# Altium schematic sheet Sheet1.SchDoc
size A4
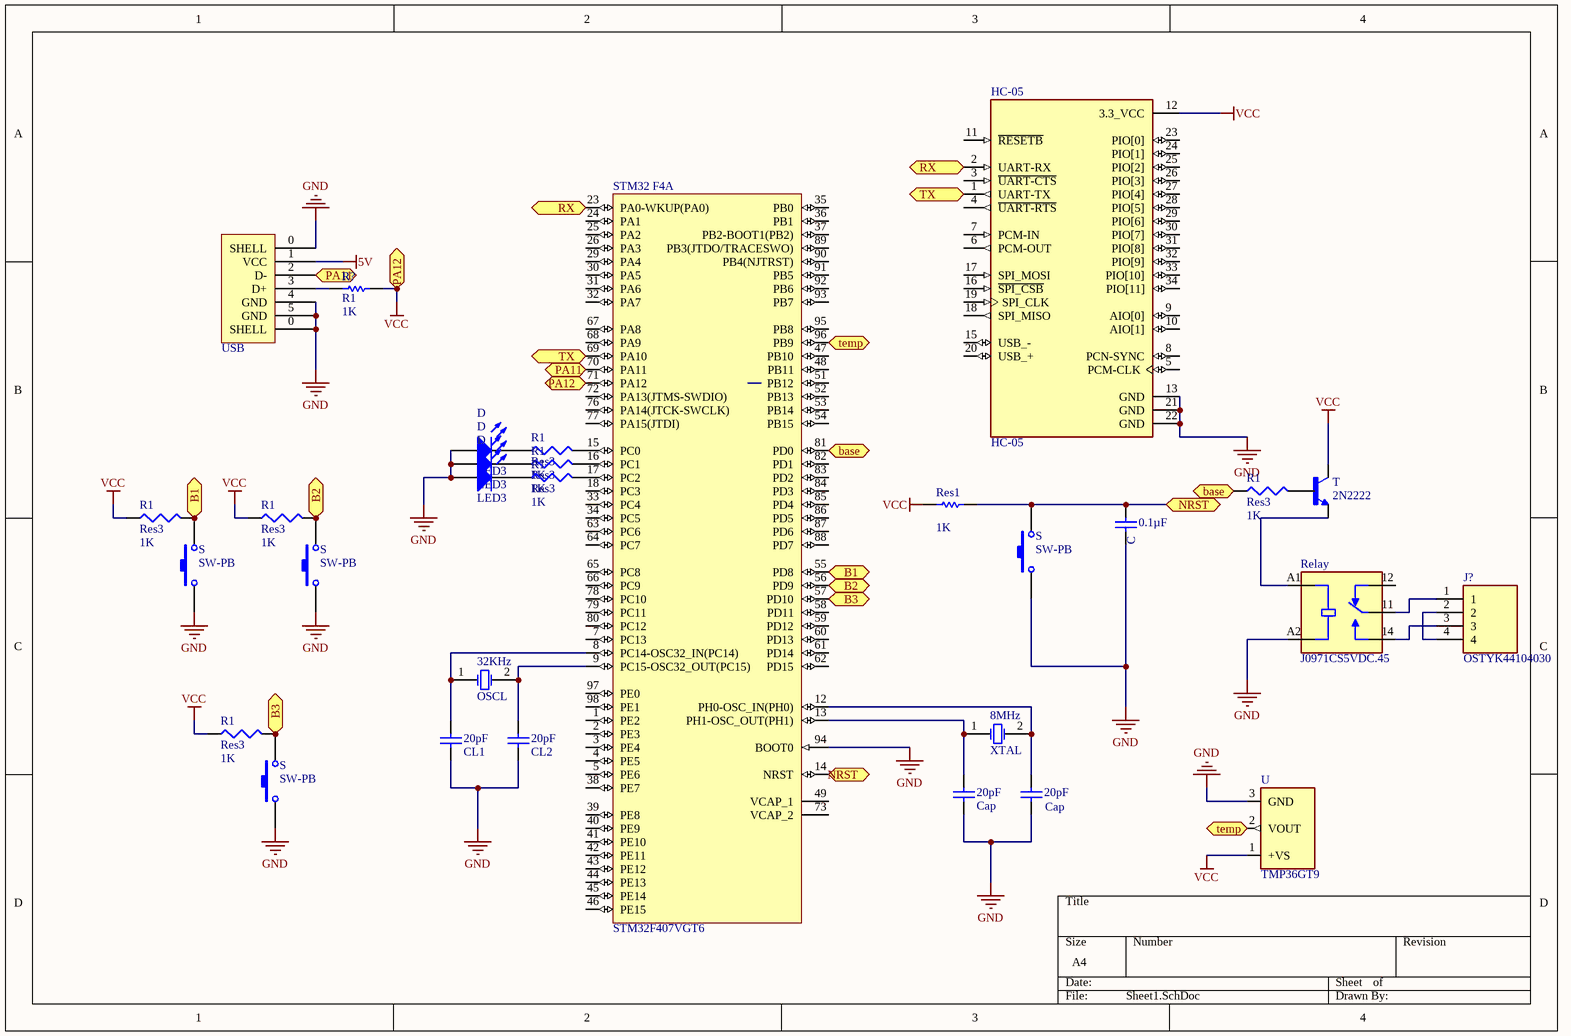
[diagram p0: Sheet1.SchDoc]

## Parts
(Parts that share a designator on the sheet are numbered #1, #2 ... from top to bottom, then left to right.)
0.1µF  C  [RAD-0.3]
8MHz  XTAL  [R38]
20pF#1  CL1  [RAD-0.3]
20pF#2  CL2  [RAD-0.3]
20pF#3  Cap  [RAD-0.3]
20pF#4  Cap  [RAD-0.3]
32KHz  OSCL  [R38]
D#1  LED3  [3.5X2.8X1.9]
D#2  LED3  [3.5X2.8X1.9]
D#3  LED3  [3.5X2.8X1.9]
HC-05  HC-05  [XCVR_HC-05]
J?  OSTYK44104030  [OST_OSTYK44104030]
R1#1  Res3  value 1K  [J1-0603]
R1#2  Res3  value 1K  [J1-0603]
R1#3  Res3  value 1K  [J1-0603]
R1#4  Res3  value 1K  [J1-0603]
R1#5  Res3  value 1K  [J1-0603]
R1#6  Res3  value 1K  [J1-0603]
R1#7  Res3  value 1K  [J1-0603]
R?  R1  value 1K  [AXIAL-0.3]
Relay  J0971CS5VDC.45  [RELAY_J0971CS5VDC.45]
Res1  value 1K  [AXIAL-0.3]
S#1  SW-PB  [SPST-2]
S#2  SW-PB  [SPST-2]
S#3  SW-PB  [SPST-2]
S#4  SW-PB  [SPST-2]
STM32_F4  STM32F407VGT6  [STM-LQFP100_N]  (part A of 2)
T  2N2222  [TO127P584H533-3]
U  TMP36GT9  [XDCR_TMP36GT9]
USB  USB connector  [usb_B]  (value not drawn)

## Ports
B1, B2, B3, base, NRST, PA11, PA12, RX, temp, TX

## Nets
5V: USB.1(VCC)
GND: 0.1µF.1 20pF#1.1 20pF#2.1 20pF#3.1 20pF#4.1 D#1.1(A) D#2.1(A) D#3.1(A) HC-05.13(GND) HC-05.21(GND) HC-05.22(GND) Relay.A2(COIL2) S#1.1 S#2.1 S#3.1 S#4.1 STM32_F4.94(BOOT0) U.3(GND) USB.0(SHELL) USB.4(GND) USB.5(GND)
VCC: HC-05.12(3.3_VCC) R1#5.1 R1#6.1 R1#7.1 R?.2 Res1.1 STM32_F4.71(PA12) T.3(C) U.1(+VS) ; port PA12
B1: R1#5.2 S#2.2 STM32_F4.55(PD8) ; port B1
B2: R1#6.2 S#3.2 STM32_F4.56(PD9) ; port B2
B3: R1#7.2 S#4.2 STM32_F4.57(PD10) ; port B3
base: R1#4.1 STM32_F4.81(PD0) ; port base
NRST: 0.1µF.2 Res1.2 S#1.2 STM32_F4.14(NRST) ; port NRST
PA11: STM32_F4.70(PA11) USB.2(D-) ; port PA11
RX: HC-05.2(UART-RX) STM32_F4.23(PA0-WKUP(PA0)) ; port RX
temp: STM32_F4.96(PB9) U.2(VOUT) ; port temp
TX: HC-05.1(UART-TX) STM32_F4.69(PA10) ; port TX
Net8MHz_1: 8MHz.1(OSC1) 20pF#3.2 STM32_F4.13(PH1-OSC_OUT(PH1))
Net8MHz_2: 8MHz.2(OSC2) 20pF#4.2 STM32_F4.12(PH0-OSC_IN(PH0))
Net20pF#1_2: 20pF#1.2 32KHz.1(OSC1) STM32_F4.8(PC14-OSC32_IN(PC14))
Net20pF#2_2: 20pF#2.2 32KHz.2(OSC2) STM32_F4.9(PC15-OSC32_OUT(PC15))
NetD#1_2: D#1.2(K) R1#1.1
NetD#2_2: D#2.2(K) R1#2.1
NetD#3_2: D#3.2(K) R1#3.1
NetJ?_1: J?.1 Relay.11(COM)
NetJ?_2: J?.2 J?.4
NetJ?_3: J?.3 Relay.14(NO)
NetR1#1_2: R1#1.2 STM32_F4.15(PC0)
NetR1#2_2: R1#2.2 STM32_F4.16(PC1)
NetR1#3_2: R1#3.2 STM32_F4.17(PC2)
NetR1#4_2: R1#4.2 T.2(B)
NetR?_1: R?.1 USB.3(D+)
NetRelay_A1: Relay.A1(COIL1) T.1(E)

Not connected (* = marked no-connect by the designer): HC-05 3(~{UART-CTS}) 4(~{UART-RTS}) 5(PCM-CLK) 6(PCM-OUT) 7(PCM-IN) 8(PCN-SYNC) 9(AIO[0]) 10(AIO[1]) 11(~{RESETB}) 15(USB_-) 16(~{SPI_CSB}) 17(SPI_MOSI) 18(SPI_MISO) 19(SPI_CLK) 20(USB_+) 23(PIO[0]) 24(PIO[1]) 25(PIO[2]) 26(PIO[3]) 27(PIO[4]) 28(PIO[5]) 29(PIO[6]) 30(PIO[7]) 31(PIO[8]) 32(PIO[9]) 33(PIO[10]) 34(PIO[11]); Relay 12(NC); STM32_F4 1(PE2) 2(PE3) 3(PE4) 4(PE5) 5(PE6) 7(PC13) 18(PC3) 24(PA1) 25(PA2) 26(PA3) 29(PA4) 30(PA5) 31(PA6) 32(PA7) 33(PC4) 34(PC5) 35(PB0) 36(PB1) 37(PB2-BOOT1(PB2)) 38(PE7) 39(PE8) 40(PE9) 41(PE10) 42(PE11) 43(PE12) 44(PE13) 45(PE14) 46(PE15) 47(PB10) 48(PB11) 49(VCAP_1) 51(PB12) 52(PB13) 53(PB14) 54(PB15) 58(PD11) 59(PD12) 60(PD13) 61(PD14) 62(PD15) 63(PC6) 64(PC7) 65(PC8) 66(PC9) 67(PA8) 68(PA9) 72(PA13(JTMS-SWDIO)) 73(VCAP_2) 76(PA14(JTCK-SWCLK)) 77(PA15(JTDI)) 78(PC10) 79(PC11) 80(PC12) 82(PD1) 83(PD2) 84(PD3) 85(PD4) 86(PD5) 87(PD6) 88(PD7) 89(PB3(JTDO/TRACESWO)) 90(PB4(NJTRST)) 91(PB5) 92(PB6) 93(PB7) 95(PB8) 97(PE0) 98(PE1)

## Library data of the parts
0.1µF 20pF#1-20pF#4 = Cap: Capacitor; Published: 8-Jun-2000; LatestRevisionDate: 17-Jul-2002; LatestRevisionNote: Re-released for DXP Platform.; PackageReference: RAD-0.3; Publisher: Altium Limited; PackageDescription: Radial Cap, Thru-Hole; 2 Leads; 0.3 in Pin Spacing
8MHz 32KHz = XTAL: Crystal Oscillator; Published: 8-Jun-2000; LatestRevisionDate: 17-Jul-2002; LatestRevisionNote: Re-released for DXP Platform.; PackageReference: R38; Publisher: Altium Limited; PackageDescription: Crystal, Thru-Hole; 2 Leads; Body 3.1 x 8.2 mm (Dia.xH)
D#1-D#3 = LED3: Typical BLUE SiC LED; Published: 8-Jun-2000; LatestRevisionDate: 17-Dec-2003; LatestRevisionNote: PCB Footprint replaced.; DatasheetVersion: 16-Apr-2002; PackageVersion: 16-Apr-2002; PackageReference: 3.5X2.8X1.9; Publisher: Altium Limited; PackageDescription: SM LED; 2 C-Bend Leads; Body 3.5 x 2.8 x 1.9 mm, inc leads (LxWxH typ)
HC-05 = HC-05: Bluetooth to Serial Port Module; MP: HC-05; Value: *; Price: None; Package: None; Availability: Unavailable
J? = OSTYK44104030: 4 Circuit 0.374 (9.50mm) Barrier Block Connector, Screws with Captive Plate; MF: On Shore; MP: OSTYK44104030; Purchase-URL: https://pricing.snapeda.com/search/part/OSTYK44104030/?ref=eda; Price: None; SnapEDA_Link: https://www.snapeda.com/parts/OSTYK44104030/On+Shore+Technology+Inc./view-part/?ref=snap; Check_prices: https://www.snapeda.com/parts/OSTYK44104030/On+Shore+Technology+Inc./view-part/?ref=eda; Package: None; Availability: In Stock; Value: *
R1#1-R1#7 = Res3: Resistor; Published: 8-Jun-2000; LatestRevisionDate: 29-May-2009; LatestRevisionNote: IPC-7351 Footprint Added.; PackageReference: J1-0603; Publisher: Altium Limited; PackageDescription: Chip Resistor
R? Res1 = Res1: Resistor; Published: 8-Jun-2000; LatestRevisionDate: 17-Jul-2002; LatestRevisionNote: Re-released for DXP Platform.; PackageReference: AXIAL-0.3; Publisher: Altium Limited; PackageDescription: Axial Device, Thru-Hole; 2 Leads; 0.3 in Pin Spacing
Relay = J0971CS5VDC.45: General Purpose Relay SPDT (1 Form C) 5VDC Coil Through Hole; MF: CIT Relay and Switch; Value: *; SnapEDA_Link: https://www.snapeda.com/parts/J0971CS5VDC.45/CIT+Relay+%2526+Switch/view-part/?ref=snap; MP: J0971CS5VDC.45; Purchase-URL: https://pricing.snapeda.com/search/part/J0971CS5VDC.45/?ref=eda; Check_prices: https://www.snapeda.com/parts/J0971CS5VDC.45/CIT+Relay+%2526+Switch/view-part/?ref=eda; Availability: In Stock; Price: None; Package: None
S#1-S#4 = SW-PB: Switch; Published: 24-Mar-1999; LatestRevisionDate: 17-Jul-2002; LatestRevisionNote: Re-released for DXP Platform.; PackageReference: SPST-2; Publisher: Altium Limited; PackageDescription: Switch; 2 Leads
STM32_F4 = STM32F407VGT6: ARM Cortex-M4 32-bit MCU+FPU, 210 DMIPS, 1024 kB Flash, 192 kB Internal RAM, 82 I/Os, 100-pin LQFP, -40 to 85 degC, Tray; Manufacturer: STMicroelectronics; D/A Converter: 2x12-bit; FLASH Size (Prog) (kB): 1024; I/Os (High Current): 82; Internal RAM Size (kB): 192; Operating Frequency(F) (Processor speed) (MHz): 168; Supply Voltage(Vcc) max (V): 3.6; Supply Voltage(Vcc) min (V): 1.8; DatasheetVersion: Rev. 4; PackageVersion: Rev. 1, 06/2013; PackageReference: LQFP100; PackageDescription: 100-Pin Low Profile Quad Flat Package, 14 x 14 mm Body, 0.5 mm Pitch; Supplier 1: Digi-Key; Supplier Part Number 1: 497-11605-ND; Supplier 2: Farnell; Supplier Part Number 2: 2064368; Supplier 3: Newark; Supplier Part Number 3: 73T2333; Supplier 4: Mouser; Supplier Part Number 4: 511-STM32F407VGT6; Core: ARM Cortex-M4; Packing: Tray; Mounting Technology: Surface Mount; PartNumber: STM32F407VGT6; ComponentLink1Description: Manufacturer URL; ComponentLink1URL: http://www.st.com/web/en/home.html; ComponentLink2Description: Datasheet; ComponentLink2URL: http://www.st.com/st-web-ui/static/active/en/resource/technical/document/datasheet/DM00037051.pdf; ComponentLink3Description: Package Specification; ComponentLink3URL: http://www.st.com/st-web-ui/static/active/en/resource/technical/document/data_brief/DM00071938.pdf
T = 2N2222: Bipolar (BJT) Transistor NPN 50V 800mA 300mW Surface Mount Ceramic SMD; MF: ON Semiconductor; Check_prices: https://www.snapeda.com/parts/2N2222/Onsemi/view-part/?ref=eda; Value: *; Availability: In Stock; MP: 2N2222; Price: None; Package: TO-18 Texas Instruments; SnapEDA_Link: https://www.snapeda.com/parts/2N2222/Onsemi/view-part/?ref=snap; Purchase-URL: https://pricing.snapeda.com/search/part/2N2222/?ref=eda
U = TMP36GT9: Temperature Sensor Analog, Local -40Â°C ~ 125Â°C 10mV/Â°C TO-92-3; MF: Analog Devices; Value: *; SnapEDA_Link: https://www.snapeda.com/parts/TMP36GT9/Analog%20Devices%20Inc./view-part/473355/?ref=snap; MP: TMP36GT9; Availability: Unavailable; Price: None; Package: TO-92 Analog Devices
USB = USB-B